# Altium schematic sheet Sheet1.SchDoc
size A; SheetNumber: 1; SheetTotal: 1
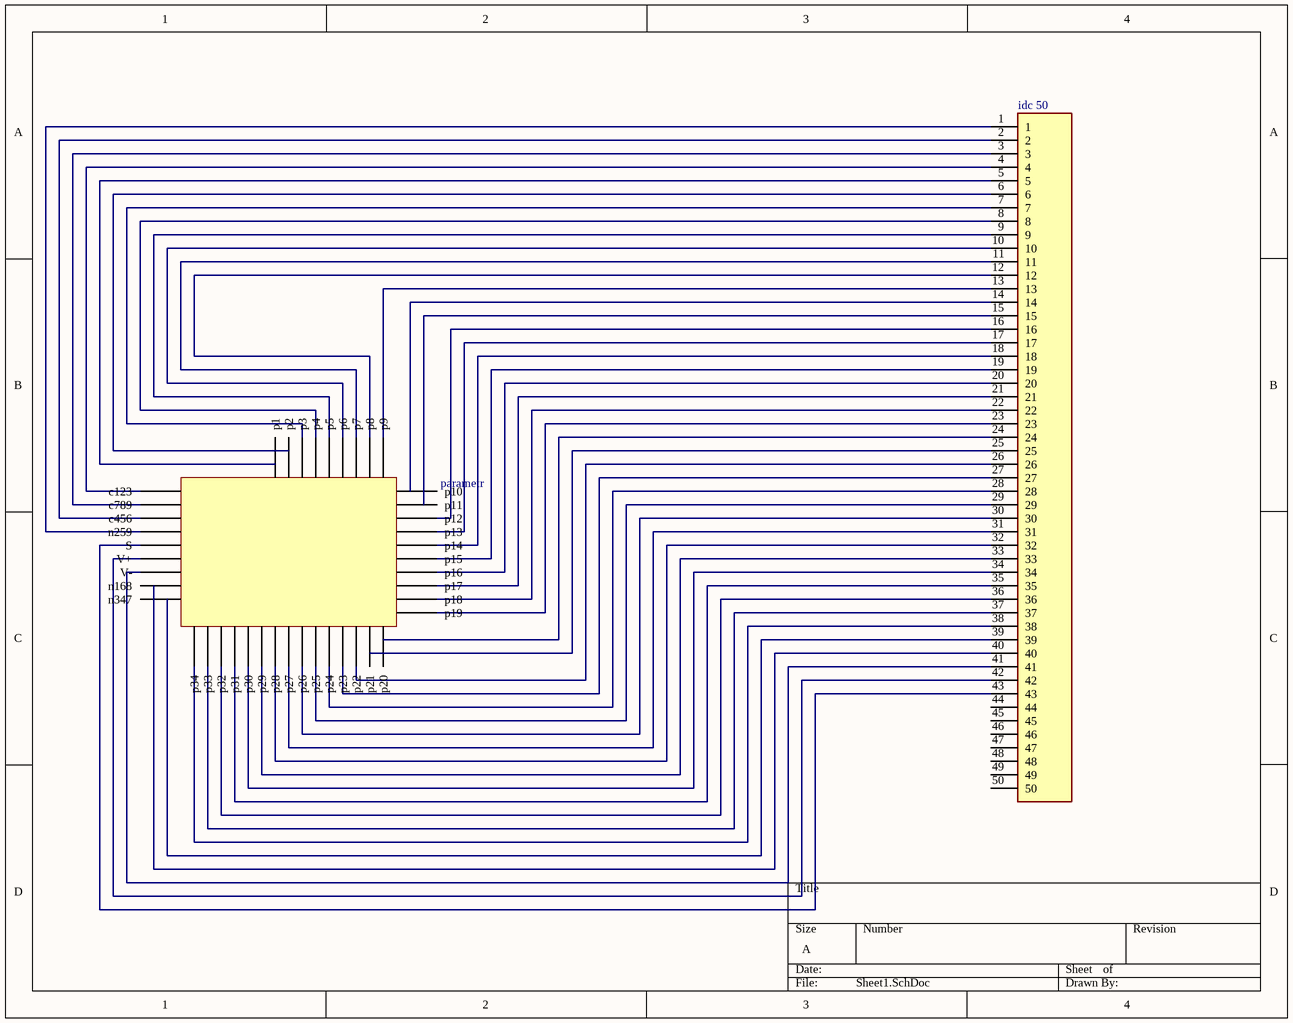
[diagram p0: Sheet1.SchDoc]

## Parts
*  parametr
idc_50  1-1761686-5  [TE_1-1761686-5]  (value not drawn)

## Nets

Not connected (* = marked no-connect by the designer): * 15(c123) 16(c789) 17(c456) 18(n259) 19(n168) 20(n347) 24(p10) 25(p11) 26(p12) 27(p13) 28(p14) 29(p15) 30(p16) 31(p17) 32(p18) 33(p19) 34(p20) 35(p21) 36(p22) 37(p23) 38(p24) 39(p25) 40(p26) 41(p27) 42(p28) 43(p29) 44(p30) 45(p31) 46(p32) 47(p33) 48(p34) 49(p9) 50(p8) 51(p7) 52(p6) 53(p5) 54(p4) 55(p3) 56(p2) 57(p1) 58(S) 59(V+) 60(V-); idc_50 1 2 3 4 5 6 7 8 9 10 11 12 13 14 15 16 17 18 19 20 21 22 23 24 25 26 27 28 29 30 31 32 33 34 35 36 37 38 39 40 41 42 43 44 45 46 47 48 49 50

## Library data of the parts
* = key
idc_50 = 1-1761686-5: Package: None; Price: None; Value: *; MP: 1-1761686-5; Availability: Unavailable